# EAGLE design motor (EAGLE 9.6.2)
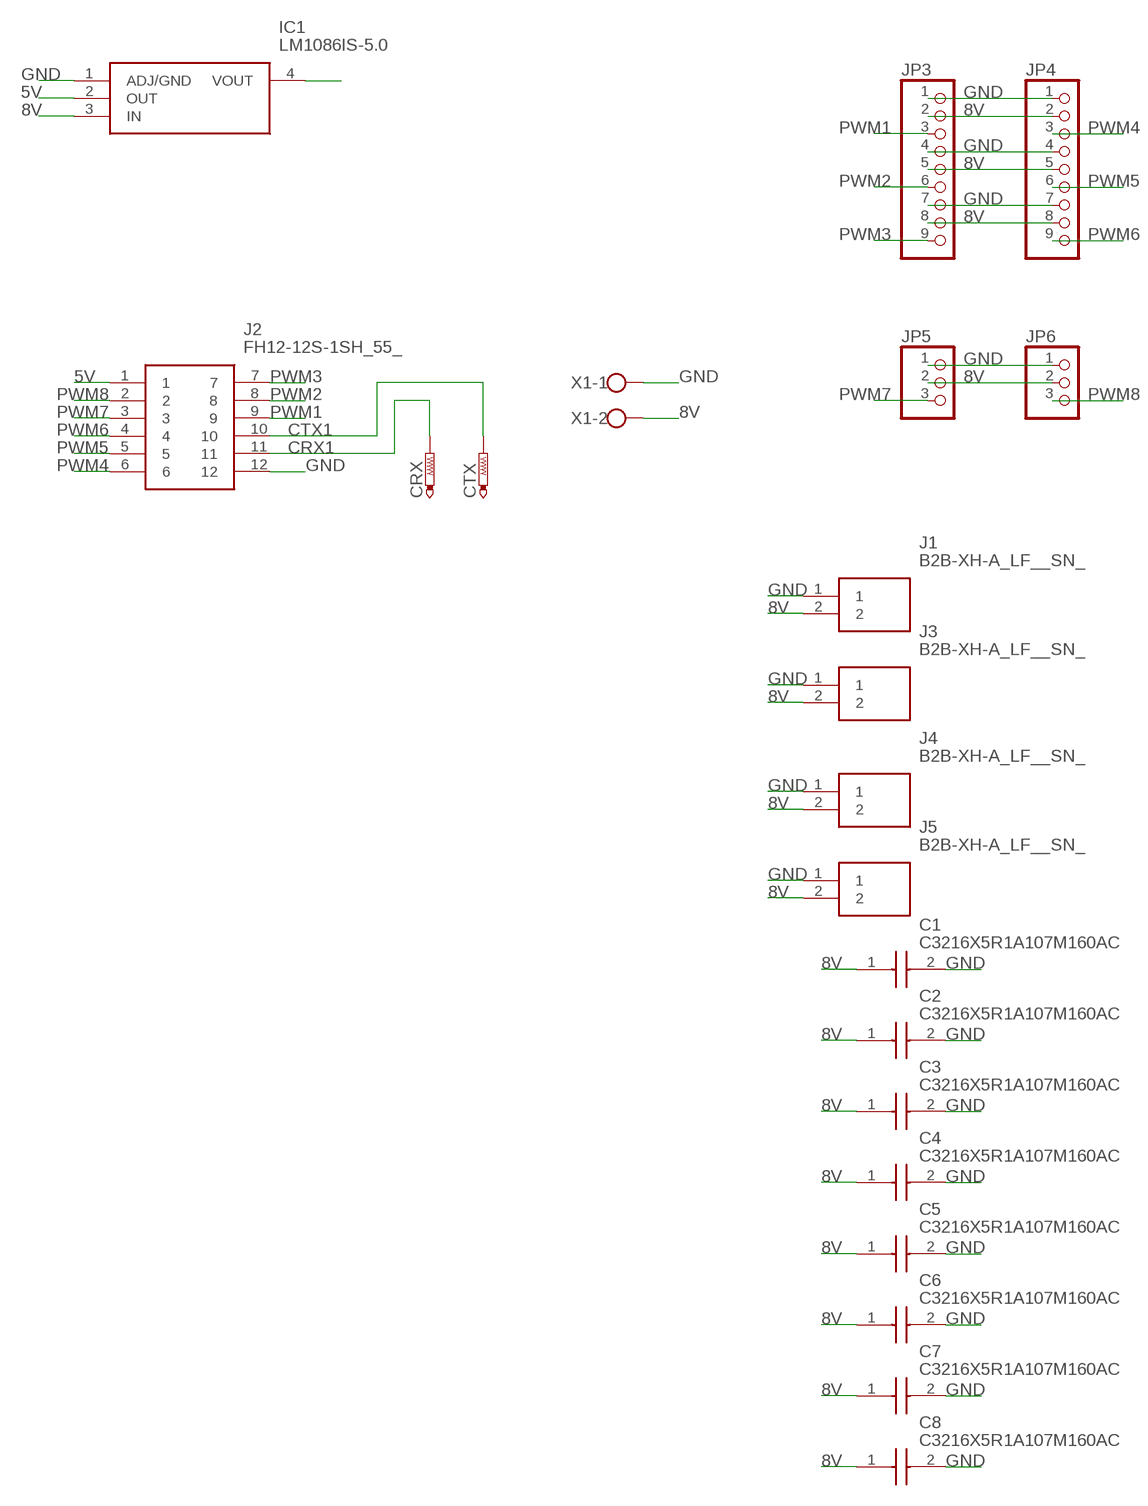
[diagram p0: schematic, sheet 1]

## Parts
C1  C3216X5R1A107M160AC  [CAPC3216X180N]
C2  C3216X5R1A107M160AC  [CAPC3216X180N]
C3  C3216X5R1A107M160AC  [CAPC3216X180N]
C4  C3216X5R1A107M160AC  [CAPC3216X180N]
C5  C3216X5R1A107M160AC  [CAPC3216X180N]
C6  C3216X5R1A107M160AC  [CAPC3216X180N]
C7  C3216X5R1A107M160AC  [CAPC3216X180N]
C8  C3216X5R1A107M160AC  [CAPC3216X180N]
CRX  PTR1TP20R  [TP20R]
CTX  PTR1TP20SQ  [TP20SQ]
IC1  LM1086IS-5.0  [TO254P1435X457-4N]
J1  B2B-XH-A_LF__SN_  [SHDR2W64P0X250_1X2_740X575X700]
J2  FH12-12S-1SH_55_  [FH12-12S-1SH(55)]
J3  B2B-XH-A_LF__SN_  [SHDR2W64P0X250_1X2_740X575X700]
J4  B2B-XH-A_LF__SN_  [SHDR2W64P0X250_1X2_740X575X700]
J5  B2B-XH-A_LF__SN_  [SHDR2W64P0X250_1X2_740X575X700]
JP3  PINHD-1X9  [1X09]
JP4  PINHD-1X9  [1X09]
JP5  PINHD-1X3  [1X03]
JP6  PINHD-1X3  [1X03]
X1  W237-102  [W237-102]

## Nets
5V: IC1.2(OUT) J2.1
8V: C1.1 C2.1 C3.1 C4.1 C5.1 C6.1 C7.1 C8.1 IC1.3(IN) J1.2 J3.2 J4.2 J5.2 JP3.2 JP3.5 JP3.8 JP4.2 JP4.5 JP4.8 JP5.2 JP6.2 X1.2
CRX1: CRX.TP J2.11
CTX1: CTX.TP J2.10
GND: C1.2 C2.2 C3.2 C4.2 C5.2 C6.2 C7.2 C8.2 IC1.1(ADJ/GND) J1.1 J2.12 J3.1 J4.1 J5.1 JP3.1 JP3.4 JP3.7 JP4.1 JP4.4 JP4.7 JP5.1 JP6.1 X1.1
N$4: IC1.4(VOUT)
PWM1: J2.9 JP3.3
PWM2: J2.8 JP3.6
PWM3: J2.7 JP3.9
PWM4: J2.6 JP4.3
PWM5: J2.5 JP4.6
PWM6: J2.4 JP4.9
PWM7: J2.3 JP5.3
PWM8: J2.2 JP6.3

## Library data of the parts
C1-C8 = SamacSys_Parts:C3216X5R1A107M160AC: 1206 X5R ceramic capacitor 100uF 10V TDK 1206 C 100uF Ceramic Multilayer Capacitor, 10 V dc, +85degC, X5R Dielectric, /-20% SMD Source: Datasheet <https://product.tdk.com/info/en/catalog/datasheets/mlcc_commercial_midvoltage_en.pdf>; ARROW_PART_NUMBER: C3216X5R1A107M160AC; ARROW_PRICE-STOCK: https://www.arrow.com/en/products/c3216x5r1a107m160ac/tdk; DESCRIPTION: 1206 X5R ceramic capacitor 100uF 10V TDK 1206 C 100uF Ceramic Multilayer Capacitor, 10 V dc, +85degC, X5R Dielectric, /-20% SMD; HEIGHT: 1.8mm; MANUFACTURER_NAME: TDK; MANUFACTURER_PART_NUMBER: C3216X5R1A107M160AC; MOUSER_PART_NUMBER: 810-C3216X5R1A107M; MOUSER_PRICE-STOCK: https://www.mouser.co.uk/ProductDetail/TDK/C3216X5R1A107M160AC/?qs=NRhsANhppD%252B0MpDu1pf9NA%3D%3D
CRX CTX = testpad:PTR1: TEST PIN
IC1 = SamacSys_Parts:LM1086IS-5.0: 1.5-A fixed- and adjustable-output linear regulator Source: Datasheet <http://www.ti.com/lit/gpn/LM1086>; DESCRIPTION: 1.5-A fixed- and adjustable-output linear regulator; HEIGHT: mm; MANUFACTURER_NAME: Texas Instruments; MANUFACTURER_PART_NUMBER: LM1086IS-5.0; MOUSER_PART_NUMBER: 926-LM1086IS-50; MOUSER_PRICE-STOCK: https://www.mouser.co.uk/ProductDetail/Texas-Instruments/LM1086IS-50?qs=X1J7HmVL2ZFtUy72NpTY9g%3D%3D
J1 J3-J5 = SamacSys_Parts:B2B-XH-A_LF__SN_: JST XH Series, 2.5mm Pitch 2 Way 1 Row Straight PCB Header, Solder Termination, 3A Source: Datasheet <http://uk.rs-online.com/web/p/products/8201554P>; DESCRIPTION: JST XH Series, 2.5mm Pitch 2 Way 1 Row Straight PCB Header, Solder Termination, 3A; HEIGHT: 7mm; MANUFACTURER_NAME: JST (JAPAN SOLDERLESS TERMINALS); MANUFACTURER_PART_NUMBER: B2B-XH-A(LF)(SN); RS_PART_NUMBER: 8201554P; RS_PRICE-STOCK: http://uk.rs-online.com/web/p/products/8201554P
J2 = SamacSys_Parts:FH12-12S-1SH_55_: Hirose FH12 Series 1mm Pitch 12 Way 1 Row Right Angle SMT Female FPC Connector, Gold Plated Contacts Source: Datasheet <https://www.hirose.com/product/en/download_file/key_name/FH12-12S-1SH(55)/category/Drawing (2D)/doc_file_id/54730/?file_category_id=6&item_id=05860741755&is_series=>; DESCRIPTION: Hirose FH12 Series 1mm Pitch 12 Way 1 Row Right Angle SMT Female FPC Connector, Gold Plated Contacts; HEIGHT: mm; MANUFACTURER_NAME: Hirose; MANUFACTURER_PART_NUMBER: FH12-12S-1SH(55); MOUSER_PART_NUMBER: 798-FH1212S1SH55; MOUSER_PRICE-STOCK: https://www.mouser.co.uk/ProductDetail/Hirose-Connector/FH12-12S-1SH55?qs=c1kC0VY36quFRZuv9h%2Fjmw%3D%3D
JP3 JP4 = pinhead:PINHD-1X9: PIN HEADER
JP5 JP6 = pinhead:PINHD-1X3: PIN HEADER
X1 = con-wago-500:W237-102: WAGO SCREW CLAMP; MPN: 237-102; OC_FARNELL: unknown; OC_NEWARK: 70K9898

## Board
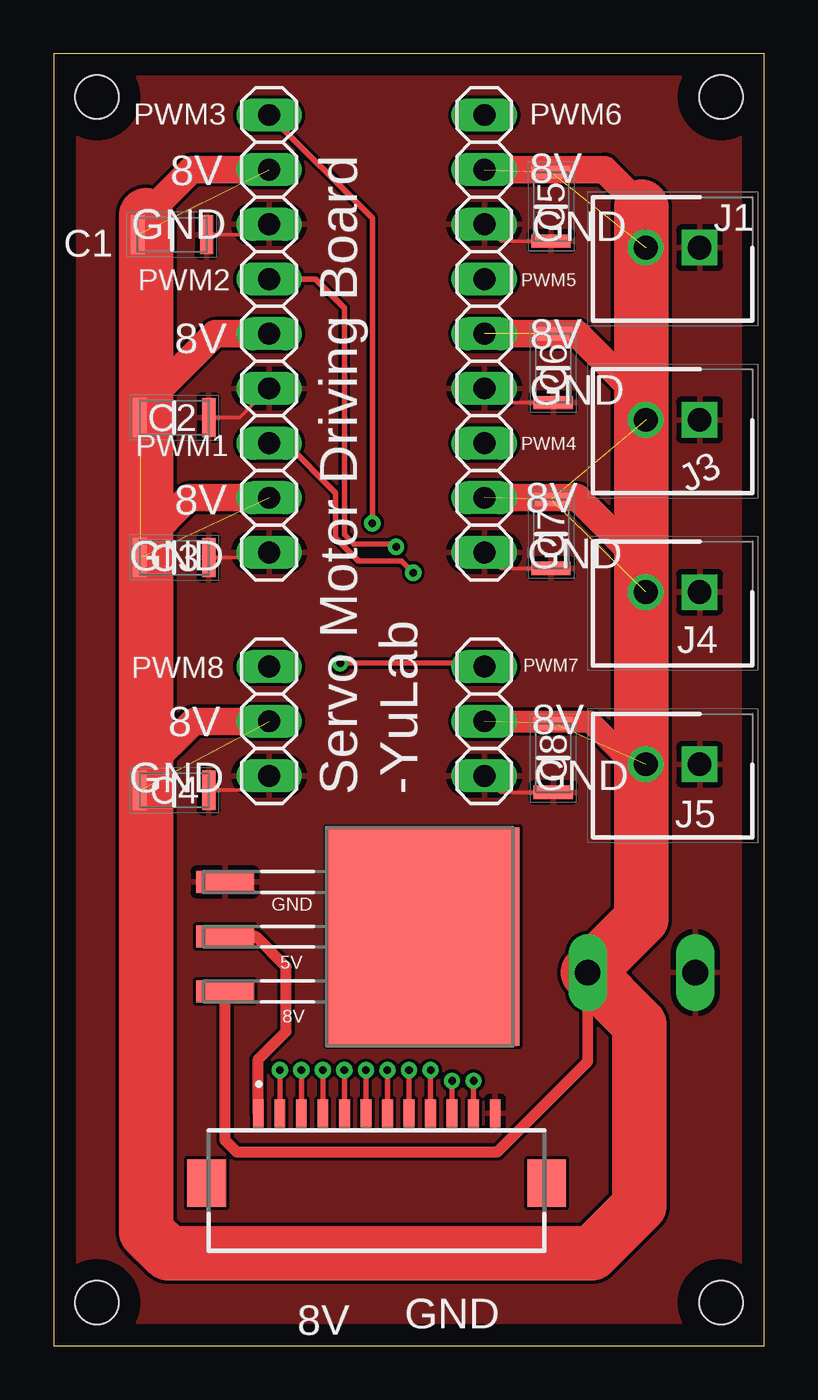
[diagram p1: board, top side]
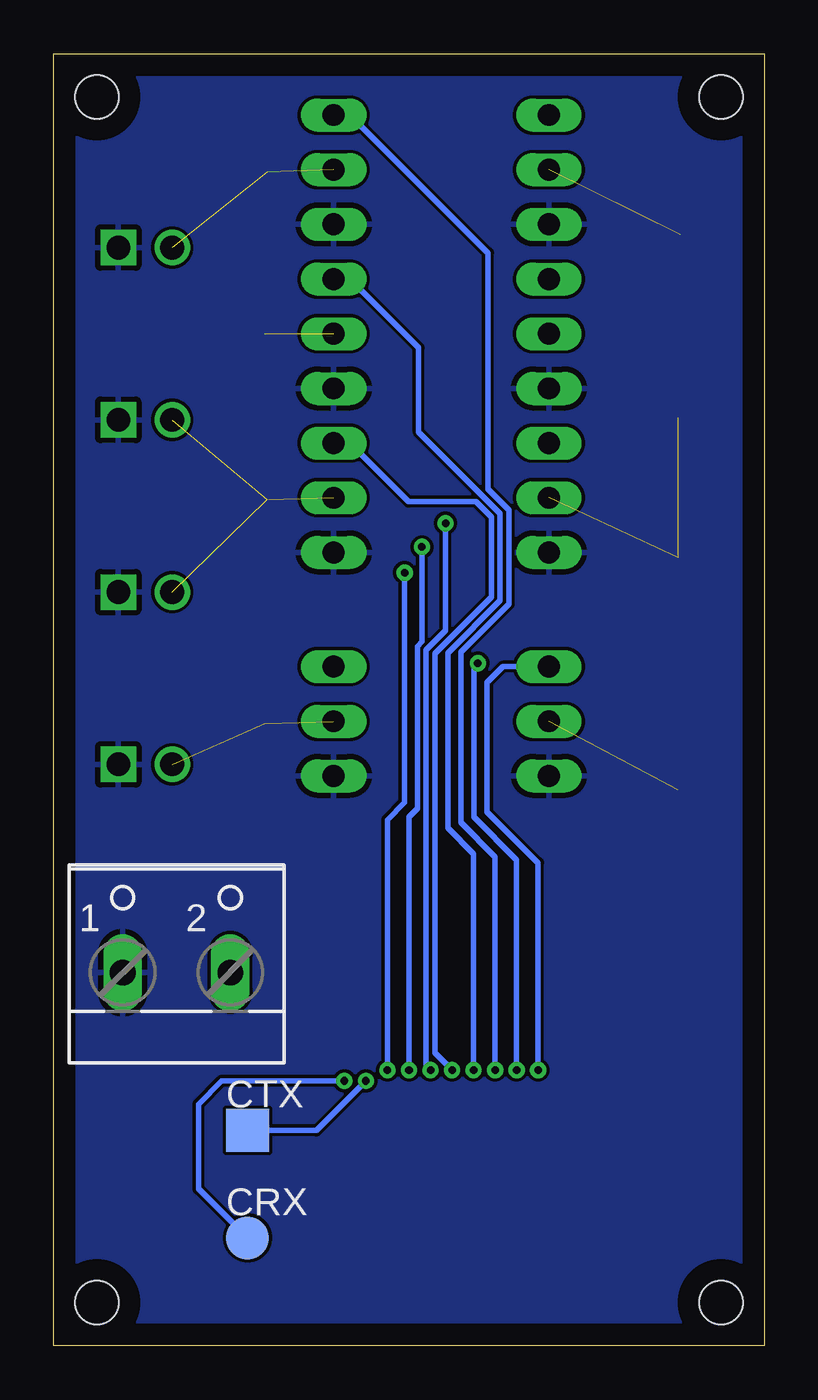
[diagram p2: board, bottom side, seen from below]

Size 33 x 60 mm. Coordinates in mm from the lower left corner, seen from the top.
Outline: 0,0 33,0 33,60 0,60 0,0
Copper layers (1*16): Top 0.035mm / dielectric 1.5mm / Bottom 0.035mm
Design rules "default": minimum track width 6mil, minimum drill 0.35mm, track to track 6mil, track to pad 6mil, pad to pad 6mil, via to via 6mil, smd to smd 6mil, copper to edge 40mil, drill to drill 6mil, minimum pad ring 10mil, minimum via ring 8mil, stop-mask expansion 4mil, vias tented up to drill 0mil, thermal gap 10mil
Holes 2 mm at 2,58 2,2 31,58 31,2

### Footprints (pad centres in the part's own frame; a part is rotated, then mirrored left to right if it is on the bottom)
CAPC3216X180N = smd 0.62 x 1.82: 1 -1.6,0; 2 1.6,0
TP20R = smd 2 x 2: TP 0,0
TP20SQ = smd 2 x 2: TP 0,0
TO254P1435X457-4N = smd 1.016 x 2.692: 1 -2.54,-9.042; 2 0,-9.042; 3 2.54,-9.042 | smd 10.16 x 8.941: 4 0,0.152
SHDR2W64P0X250_1X2_740X575X700 = drill 1.1 pad 1.65 square: 1 0,0 | drill 1.1 pad 1.65: 2 2.5,0
FH12-12S-1SH(55) = smd 0.5 x 1.3: 1 -5.5,0.8; 2 -4.5,0.8; 3 -3.5,0.8; 4 -2.5,0.8; 5 -1.5,0.8; 6 -0.5,0.8; 7 0.5,0.8; 8 1.5,0.8; 9 2.5,0.8; 10 3.5,0.8; 11 4.5,0.8; 12 5.5,0.8 | smd 1.8 x 2.2: 13 -7.9,-2.45; 14 7.9,-2.45
1X09 = drill 1.016 long: 1 -10.16,0; 2 -7.62,0; 3 -5.08,0; 4 -2.54,0; 5 0,0; 6 2.54,0; 7 5.08,0; 8 7.62,0; 9 10.16,0
1X03 = drill 1.016 long: 1 -2.54,0; 2 0,0; 3 2.54,0
W237-102 = drill 1.194 long: 1 -2.5,-1.27; 2 2.5,-1.27

### Placement (x,y rotation side)
C1  5.5,51.6 0 top
C2  5.6,43.1 0 top
C3  5.6,36.6 0 top
C4  5.6,25.8 0 top
C5  23.1,52.9 270 top
C6  23.2,45.4 270 top
C7  23.1,37.7 270 top
C8  23.2,27.3 270 top
CRX  24,5 0 bottom
CTX  24,10 0 bottom
IC1  17,19 270 top
J1  30,51 180 top
J2  15,10 0 top
J3  30,43 180 top
J4  30,35 180 top
J5  30,27 180 top
JP3  10,47 90 top
JP4  20,47 90 top
JP5  20,29 90 top
JP6  10,29 90 top
X1  27.3,18.6 0 bottom

### Tracks (layer width: path | path; a pad name or v marks a point on that pad's centre or on a via)
5V
  Top 0.508: J2.1 9.5,13.3 10.8,14.6 10.8,17.6 9.4,19 IC1.2
8V  (12 unrouted)
  Top 0.508: IC1.3 7.96,9.54 8.5,9 20.6,9 24.8,13.2 X1.2
  Top 1.016: JP5.2 24.9,29 27.3,26.6
  Top 1.27: JP3.8 6.41,54.62 4.29,52.5 | JP3.5 7.49,47 4.29,43.8 | JP3.2 6.27,39.38 4.29,37.4 | JP4.8 25.58,54.62 27.3,52.9 | JP4.5 24.3,47 27.3,44 | JP4.2 24.32,39.38 27.3,36.4 | JP6.2 6.49,29 4.29,26.8
  Top 2.54: 4.29,52.5 4.29,43.8 4.29,37.4 4.29,26.8 4.29,5.3 5.3,4.29 24.99,4.29 27.2,6.5 27.2,14.93 X1.2 27.3,19.83 27.3,26.6 27.3,36.4 27.3,44 27.3,52.9
CRX1  (via drill 0.35)
  Top 0.254: J2.11 v19.5,12.3
  Bottom 0.254: CRX.TP 26.28,7.28 26.28,11.22 25.2,12.3 v19.5,12.3
CTX1  (via drill 0.35)
  Top 0.254: J2.10 v18.5,12.3
  Bottom 0.254: CTX.TP 20.8,10 v18.5,12.3
GND
  Top 0.152: C3.2 9.76,36.6 JP3.1 | C2.2 8.64,43.1 JP3.4 | C1.2 9.52,51.6 JP3.7 | C5.2 20.78,51.3 JP4.7 | C6.2 20.66,43.8 JP4.4 | C7.2 20.74,36.1 JP4.1 | C8.2 20.76,25.7 JP5.1 | C4.2 9.34,25.8 JP6.1
  pour Top: -0.5,60.7 -0.5,-0.2 1.8,-2.5 32.9,-2.5 35.7,0.3 35.7,60.5 35,61.2 0,61.2
  pour Bottom: -0.4,60.9 -0.4,-0.4 2,-2.8 33.6,-2.8 35.6,-0.8 35.6,60.8 35.5,60.9
PWM1  (via drill 0.35)
  Top 0.254: J2.9 v17.5,12.8 | JP3.3 10.78,41.92 13.09,39.61 13.09,37.5 14.15,36.44 16.16,36.44 v16.7,35.9
  Bottom 0.254: v17.5,12.8 17.5,24.42 16.7,25.22 v16.7,35.9
PWM2  (via drill 0.35)
  Top 0.254: J2.8 v16.5,12.8 | v15.9,37.1 15.76,37.24 13.93,37.24 13.5,37.67 13.5,48.2 12.16,49.54 JP3.6
  Bottom 0.254: v16.5,12.8 16.5,24.57 16.12,24.95 16.12,32.48 15.9,32.7 v15.9,37.1
PWM3  (via drill 0.35)
  Top 0.254: J2.7 v15.5,12.8 | v14.8,38.2 14.8,52.36 JP3.9
  Bottom 0.254: v15.5,12.8 15.71,13.01 15.71,32.31 14.8,33.22 v14.8,38.2
PWM4  (via drill 0.35)
  Top 0.254: J2.6 v14.5,12.8
  Bottom 0.254: v14.5,12.8 15.3,13.6 15.3,32.15 12.68,34.77 12.68,38.48 13.4,39.2 16.52,39.2 19.24,41.92 JP4.3
PWM5  (via drill 0.35)
  Top 0.254: J2.5 v13.5,12.8
  Bottom 0.254: v13.5,12.8 13.5,22.85 14.7,24.05 14.7,32.18 12.27,34.61 12.27,38.64 16.05,42.43 16.05,46.35 19.24,49.54 JP4.6
PWM6  (via drill 0.35)
  Top 0.254: J2.4 v12.5,12.8
  Bottom 0.254: v12.5,12.8 12.5,22.71 14.09,24.3 14.09,32.21 11.86,34.44 11.86,38.81 12.82,39.77 12.82,50.75 19.24,57.16 JP4.9
PWM7  (via drill 0.35)
  Top 0.254: J2.3 v11.5,12.8 | v13.3,31.7 19.84,31.7 JP5.3
  Bottom 0.254: v11.5,12.8 11.5,22.56 13.48,24.55 13.48,31.52 v13.3,31.7
PWM8  (via drill 0.35)
  Top 0.254: J2.2 v10.5,12.8
  Bottom 0.254: v10.5,12.8 10.5,22.42 12.88,24.8 12.88,30.8 12.14,31.54 JP6.3

### Text on the board
tPlace: PWM3 | PWM6 | 8V | 8V | GND | GND | PWM2 | PWM5 | 8V | 8V | GND | PWM4 | PWM1 | 8V | 8V | GND | GND | PWM8 | PWM7 | 8V | 8V | GND | Servo Motor Driving Board | -YuLab | GND | GND | 5V | 8V | GND | 8V